# EAGLE design VM_Motor_v06 (EAGLE 7.0.0)
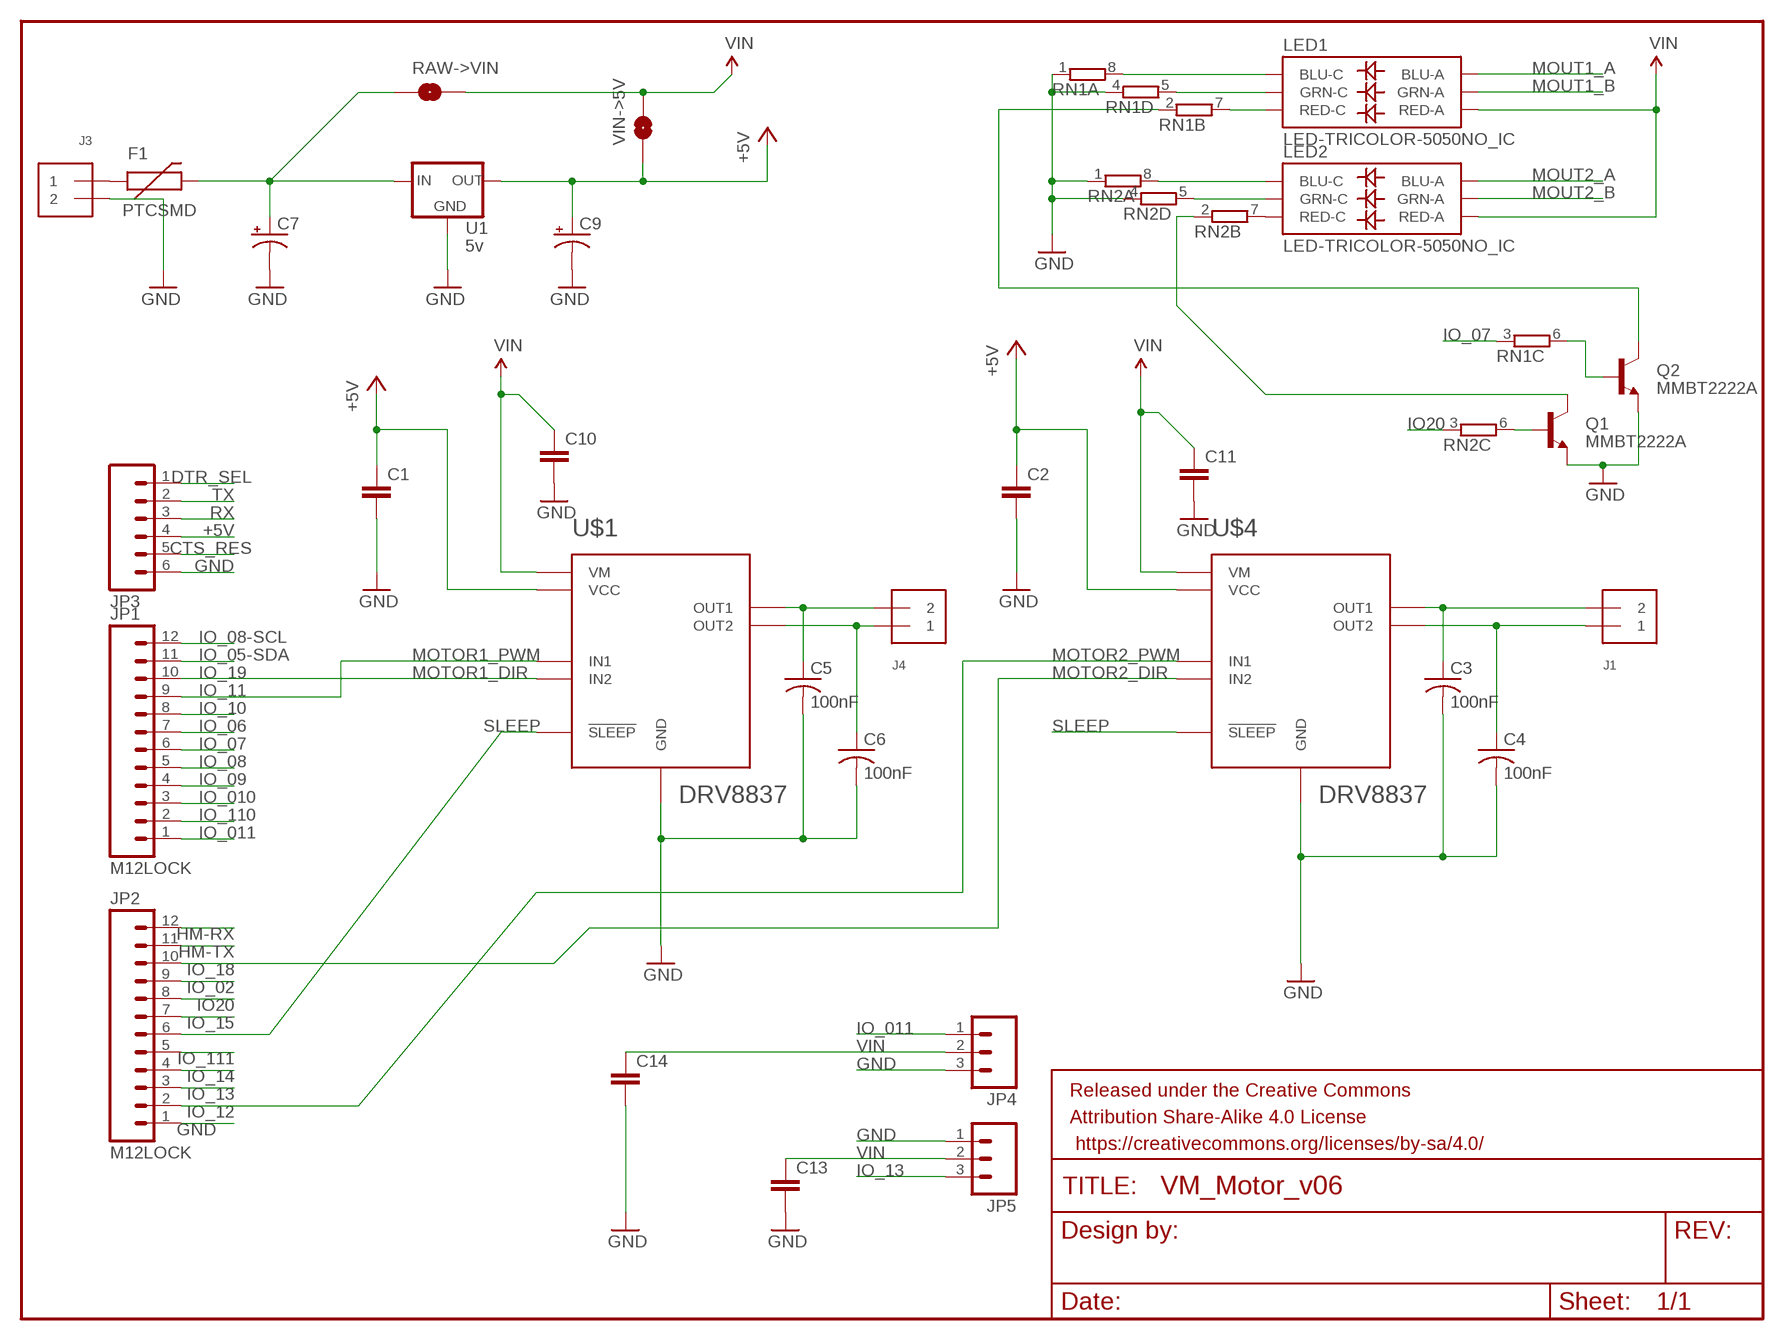
[diagram p0: schematic, sheet 1]

## Parts
C1  CAP0402-CAP  [0402-CAP]
C2  CAP0402-CAP  [0402-CAP]
C3  100nF  C-USC0402  [C0402]
C4  100nF  C-USC0402  [C0402]
C5  100nF  C-USC0402  [C0402]
C6  100nF  C-USC0402  [C0402]
C7  CPOL-US150CLZ-0810  [150CLZ-0810]
C9  CPOL-US150CLZ-0810  [150CLZ-0810]
C10  CAP0402-CAP  [0402-CAP]
C11  CAP0402-CAP  [0402-CAP]
C13  CAP0402-CAP  [0402-CAP]
C14  CAP0402-CAP  [0402-CAP]
F1  PTCSMD  [PTC-1206]
FRAME1  FRAME-LETTER  [CREATIVE_COMMONS]
J1  TERMBLOCK_1X2  [TERMBLOCK_1X2-3.5MM]
J3  TERMBLOCK_1X2  [TERMBLOCK_1X2-3.5MM]
J4  TERMBLOCK_1X2  [TERMBLOCK_1X2-3.5MM]
JP1  M12LOCK  [1X12_LOCK]
JP2  M12LOCK  [1X12_LOCK]
JP3  M06LOCK  [1X06_LOCK]
JP4  M03LOCK  [1X03_LOCK]
JP5  M03LOCK  [1X03_LOCK]
LED1  LED-TRICOLOR-5050NO_IC  [LED-TRICOLOR-5050]
LED2  LED-TRICOLOR-5050NO_IC  [LED-TRICOLOR-5050]
Q1  MMBT2222A  TRANSISTOR_NPNMMBT2222A  [SOT23-3]
Q2  MMBT2222A  TRANSISTOR_NPNMMBT2222A  [SOT23-3]
RAW->VIN  SOLDERJUMPERNO  [SJ_2S-NO]
RN1  4R-N0402ARV341  [4X0402ARV341]
RN2  4R-N0402ARV341  [4X0402ARV341]
U1  5v  V_REG_MC33269DT  [DPAK]
U$1  DRV8837  [QFN8]
U$4  DRV8837  [QFN8]
VIN->5V  SOLDERJUMPERNO  [SJ_2S-NO]

## Nets
+5V: C1.1 C2.1 C9.+ JP3.4 U1.4(OUT) U$1.P$8(VCC) U$4.P$8(VCC) VIN->5V.1
CTS_RES: JP3.5
DTR_SEL: JP3.1
GND: C1.2 C2.2 C3.2 C4.2 C5.2 C6.2 C7.- C9.- C10.2 C11.2 C13.2 C14.2 J3.2 JP2.1 JP3.6 JP4.3 JP5.1 Q1.2(E) Q2.2(E) RN1.1 RN1.4 RN2.1 RN2.4 U1.1(GND) U$1.P$4(GND) U$1.P$9(GND) U$1.P$10(GND) U$1.P$11(GND) U$4.P$4(GND) U$4.P$9(GND) U$4.P$10(GND) U$4.P$11(GND)
HM-RX: JP2.12
HM-TX: JP2.11
IO20: JP2.8 RN2.3
IO_02: JP2.9
IO_05-SDA: JP1.11
IO_06: JP1.7
IO_07: JP1.6 RN1.3
IO_08: JP1.5
IO_08-SCL: JP1.12
IO_09: JP1.4
IO_10: JP1.8
IO_010: JP1.3
IO_011: JP1.1 JP4.1
IO_13: JP2.3 JP5.3
IO_14: JP2.4
IO_15: JP2.7
IO_110: JP1.2
IO_111: JP2.5
MOTOR1_DIR: JP1.10 U$1.P$5(IN2)
MOTOR1_PWM: JP1.9 U$1.P$6(IN1)
MOTOR2_DIR: JP2.10 U$4.P$5(IN2)
MOTOR2_PWM: JP2.2 U$4.P$6(IN1)
MOUT1_A: C5.1 J4.2 LED1.3(BLU-A) U$1.P$2(OUT1)
MOUT1_B: C6.1 J4.1 LED1.1(GRN-A) U$1.P$3(OUT2)
MOUT2_A: C3.1 J1.2 LED2.3(BLU-A) U$4.P$2(OUT1)
MOUT2_B: C4.1 J1.1 LED2.1(GRN-A) U$4.P$3(OUT2)
N$2: Q1.1(B) RN2.6
N$3: LED1.4(BLU-C) RN1.8
N$4: LED1.6(GRN-C) RN1.5
N$5: LED2.4(BLU-C) RN2.8
N$7: LED1.5(RED-C) RN1.7
N$8: Q1.3(C) RN2.2
N$9: Q2.3(C) RN1.2
N$10: Q2.1(B) RN1.6
N$11: LED2.6(GRN-C) RN2.5
N$12: LED2.5(RED-C) RN2.7
N$13: F1.1 J3.1
RAW: C7.+ F1.2 RAW->VIN.1 U1.3(IN)
RX: JP3.3
SLEEP: JP2.6 U$1.P$7(!SLEEP) U$4.P$7(!SLEEP)
TX: JP3.2
VIN: C10.1 C11.1 C13.1 C14.1 JP4.2 JP5.2 LED1.2(RED-A) LED2.2(RED-A) RAW->VIN.2 U$1.P$1(VM) U$4.P$1(VM) VIN->5V.2

## Notes on the sheet
- IO_19
- IO_11
- IO_18
- IO_12

## Library data of the parts
C1 C2 C10 C11 C13 C14 = SparkFun-Capacitors:CAP: Capacitor Standard 0603 ceramic capacitor, and 0.1" leaded capacitor.
C3-C6 = resistor:C-US: CAPACITOR, American symbol
C7 C9 = resistor:CPOL-US: POLARIZED CAPACITOR, American symbol
F1 = SparkFun-PowerIC:PTC: Resettable Fuse PTC Resettable Fuse. Spark Fun Electronics SKU : COM-08357; PROD_ID: RES-11150
FRAME1 = SparkFun-Aesthetics:FRAME-LETTER: Schematic Frame Standard 8.5x11 US Letter frame
J1 J3 J4 = microbuilder:TERMBLOCK_1X2: 3.5mm Terminal block http://www.ladyada.net/library/pcb/eaglelibrary.html
JP1 JP2 = SparkFun-Connectors:M12: Header 12 Standard 12-pin 0.1" header. Use with straight break away headers (SKU : PRT-00116), right angle break away headers (PRT-00553), swiss pins (PRT-00743), machine pins (PRT-00117), and female headers (PRT-00115).
JP3 = SparkFun-Connectors:M06: Header 6 Standard 6-pin 0.1" header. Use with straight break away headers (SKU : PRT-00116), right angle break away headers (PRT-00553), swiss pins (PRT-00743), machine pins (PRT-00117), and female headers (PRT-00115). Molex polarized connector foot print use with SKU : PRT-08094 with associated crimp pins and housings. NOTES ON THE VARIANTS LOCK and LOCK_LONGPADS... This footprint was designed to help hold the alignment of a through-hole component (i.e. 6-pin header) while soldering it into place. You may notice that each hole has been shifted either up or down by 0.005 of an inch from it's more standard position (which is a perfectly straight line). This slight alteration caused the pins (the squares in the middle) to touch the edges of the holes. Because they are alternating, it causes a "brace" to hold the component in place. 0.005 has proven to be the perfect amount of "off-center" position when using our standard breakaway headers. Although looks a little odd when you look at the bare footprint, once you have a header in there, the alteration is very hard to notice. Also,if you push a header all the way into place, it is covered up entirely on the bottom side. This idea of altering the position of holes to aid alignment will be further integrated into the Sparkfun Library for other footprints. It can help hold any component with 3 or more connection pins.
JP4 JP5 = SparkFun-Connectors:M03: Header 3 Standard 3-pin 0.1" header. Use with straight break away headers (SKU : PRT-00116), right angle break away headers (PRT-00553), swiss pins (PRT-00743), machine pins (PRT-00117), and female headers (PRT-00115). Molex polarized connector foot print use with SKU : PRT-08232 with associated crimp pins and housings.
LED1 LED2 = SparkFun-LED:LED-TRICOLOR-5050
Q1 Q2 = SparkFun-DiscreteSemi:TRANSISTOR_NPN: Generic NPN BJT MMBT2222A - TRANS-08049 (SOT-23, 1A 40V) MPSA42 - TRANS-09116 (SOT-23, 500mA 300V) MMBT5088LT1G - TRANS-11160 (SOT-23, 50 mA 30V) BC547 - COM-08928 <http://www.sparkfun.com/products/8928> (TO-92 45V 100mA) (1.Collector 2.Base 3.Emitter) 2N3904 - COM-00521 <http://www.sparkfun.com/products/521> (TO-92 40V 200mA) (1.Emitter 2.Base 3.Collector) P2N2222A - COM-12852 <http://www.sparkfun.com/products/12852> (TO-92 40V 600mA) (1.Collector 2.Base 3.Emitter); PROD_ID: TRANS-08049
RAW->VIN VIN->5V = SparkFun-Retired:SOLDERJUMPER: Solder Jumper Standard SMD solder jumper. Used to automate production. Two varients : Normally Open and Normally Closed are the same, but have different paste layers. NC will have a large amount of paste and should jumper during reflow.
RN1 RN2 = resistor-dil:4R-N: Array Chip Resistor Source: RS Component / Phycomp; OC_FARNELL: unknown; OC_NEWARK: unknown
U1 = SparkFun-PowerIC:V_REG_MC33269
U$1 U$4 = bt_motordriver:DRV8837: DRV8837 Low Voltage H-Bridge The DRV8837 provides an integrated motor-driver solution for cameras, consumer products, toys, and other low-voltage or battery-powered motion-control applications. The device has one H-bridge driver, and can drive one dc motor or one winding of a stepper motor, as well as other devices like solenoids. Reference: http://www.ti.com/lit/ds/symlink/drv8837.pdf

## Board
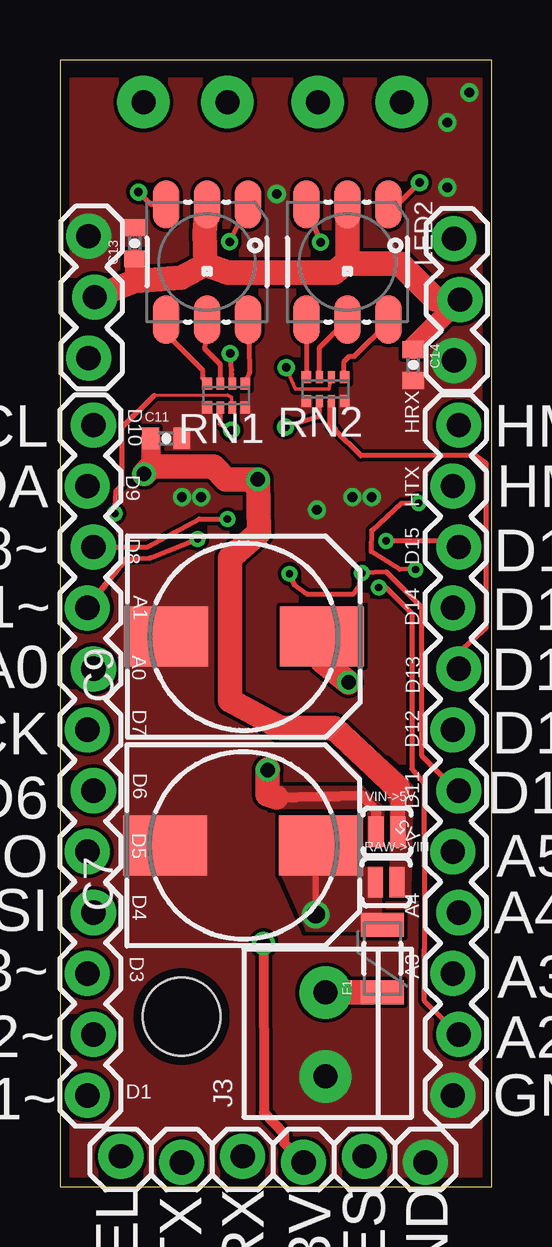
[diagram p1: board, top side]
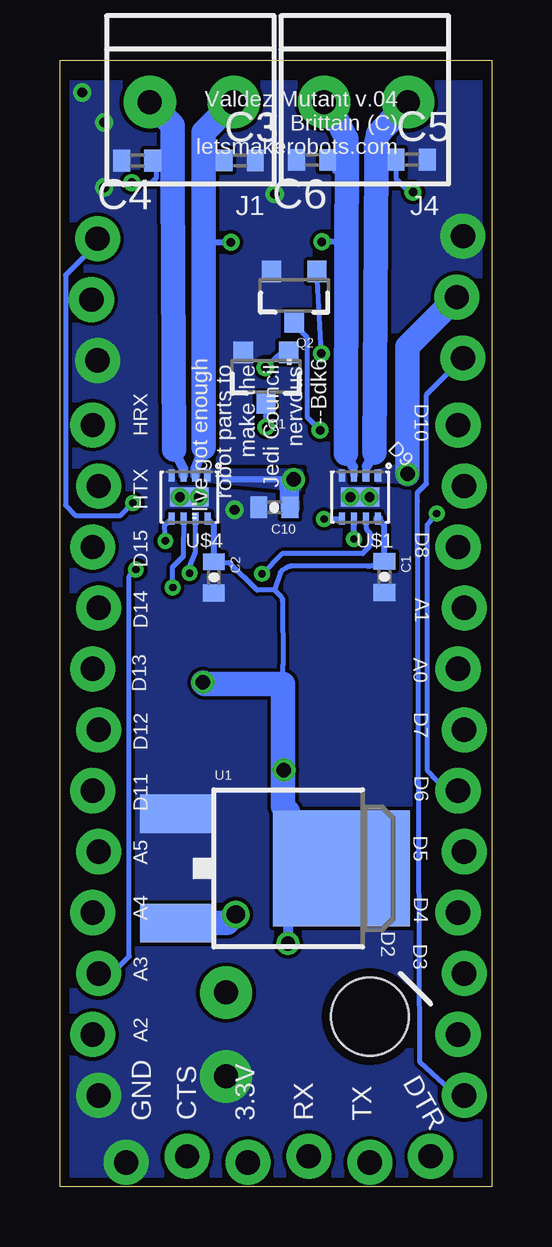
[diagram p2: board, bottom side, seen from below]

Size 18 x 46.97 mm. Coordinates in mm from the lower left corner, seen from the top.
Outline: 0,0 18,0 18,46.97 0,46.97 0,0
Copper layers (1*16): Top 0.0356mm / dielectric 1.5011mm / Bottom 0.0356mm
Design rules "LaenPCBOrder *": minimum track width 6mil, minimum drill 13mil, track to track 6mil, track to pad 6mil, pad to pad 6mil, via to via 6mil, smd to smd 6mil, copper to edge 15mil, drill to drill 6mil, minimum pad ring 7mil, minimum via ring 7mil, stop-mask expansion 3mil, vias tented up to drill 14mil, thermal gap 10mil
Holes 3.25 mm at 5.07,7.1

### Footprints (pad centres in the part's own frame; a part is rotated, then mirrored left to right if it is on the bottom)
0402-CAP = smd 0.7 x 0.9: 1 -0.65,0; 2 0.65,0
C0402 = smd 0.7 x 0.9: 1 -0.65,0; 2 0.65,0
150CLZ-0810 = smd 3.5 x 2.5: + 3.25,0; - -3.25,0
PTC-1206 = smd 1 x 1.8: 1 -1.4,0; 2 1.4,0
TERMBLOCK_1X2-3.5MM = drill 1 pad 2.184: 1 1.8,0; 2 -1.7,0
1X12_LOCK = drill 1.016 pad 1.88: 1 0,0.127; 2 2.54,-0.127; 3 5.08,0.127; 4 7.62,-0.127; 5 10.16,0.127; 6 12.7,-0.127; 7 15.24,0.127; 8 17.78,-0.127; 9 20.32,0.127; 10 22.86,-0.127; 11 25.4,0.127; 12 27.94,-0.127
1X06_LOCK = drill 1.016 pad 1.88: 1 0,0; 2 2.54,-0.254; 3 5.08,0; 4 7.62,-0.254; 5 10.16,0; 6 12.7,-0.254
1X03_LOCK = drill 1.016 pad 1.88: 1 0,0.127; 2 2.54,-0.127; 3 5.08,0.127
LED-TRICOLOR-5050 = smd 2 x 1.1: 1 -2.4,1.7; 2 -2.4,0; 3 -2.4,-1.7; 4 2.4,-1.7; 5 2.4,0; 6 2.4,1.7
SOT23-3 = smd 0.8 x 0.9: 1 -0.95,-1; 2 0.95,-1; 3 0,1.1
SJ_2S-NO = smd 0.635 x 1.27: 1 -0.45,0; 2 0.45,0
4X0402ARV341 = smd 0.4 x 0.5: 1 -0.8,-0.5; 4 0.8,-0.5; 5 0.8,0.5; 8 -0.8,0.5 | smd 0.3 x 0.5: 2 -0.25,-0.5; 3 0.25,-0.5; 6 0.25,0.5; 7 -0.25,0.5
DPAK = smd 1.6 x 3: 1 -2.28,-5.31; 3 2.28,-5.31 | smd 4.826 x 5.715: 4 0,1.588
QFN8 = smd 0.28 x 0.5: P$1 -0.75,-0.9; P$2 -0.25,-0.9 | smd 0.25 x 0.5: P$3 0.25,-0.9; P$4 0.75,-0.9; P$5 0.75,0.9; P$6 0.25,0.9; P$7 -0.25,0.9; P$8 -0.75,0.9 | smd 1.6 x 0.8: P$9 0,0 | drill 0.4 pad 0.6: P$10 0.4,0; P$11 -0.4,0

### Placement (x,y rotation side)
C1  4.47,25.43 270 bottom
C2  11.58,25.4 270 bottom
C3  10.5,42.79 0 bottom
C4  14.78,42.77 180 bottom
C5  3.33,42.81 0 bottom
C6  7.48,42.8 180 bottom
C7  7.65,14.24 0 top
C9  7.67,22.94 0 top
C10  9.06,28.32 180 bottom
C11  4.43,31.19 0 top
C13  3.12,39.33 90 top
C14  14.73,34.25 270 top
F1  13.45,9.51 90 top
FRAME1  8.64,-31.6 0 top  (outside the outline)
J1  12.46,45.21 180 bottom
J3  11.07,6.3 90 top
J4  5.18,45.21 180 bottom
JP1  1.27,3.81 90 top
JP2  16.51,3.81 90 top
JP3  2.54,1.27 0 top
JP4  1.32,34.54 90 top
JP5  16.56,34.44 90 top
LED1  6.13,38.54 270 top
LED2  11.99,38.54 270 top
Q1  9.41,33.78 180 bottom
Q2  8.23,37.16 180 bottom
RAW->VIN  13.6,12.7 0 top
RN1  6.93,32.98 0 top
RN2  11.07,33.25 0 top
U1  7.85,13.27 270 bottom
U$1  5.49,28.75 180 bottom
U$2  [OSHW_FILLX100_NOTEXT]  23.38,36.78 0 top  (outside the outline)
U$3  [OSHW_FILLX100_NOTEXT]  27.84,36.12 90 bottom  (outside the outline)
U$4  12.6,28.75 180 bottom
VIN->5V  13.64,14.8 0 top

### Tracks (layer width: path | path; a pad name or v marks a point on that pad's centre or on a via)
+5V  (via drill 0.6)
  Top 0.406: v8.49,10.14 8.51,3.1 9.35,2.23 9.35,1.83 JP3.4 | 9.04,16.23 12.57,16.31 13.18,15.7 VIN->5V.1
  Top 1.016: 9.04,16.23 8.66,16.35 v8.66,17.37 8.69,17.4 | C9.+ 10.92,21.92 v12.04,21.03
  Bottom 0.203: 9.04,24.87 8.8,25.61 arc45 8.3,25.88 5.2,25.88 arc-45 4.62,26.05 | U$4.P$8 11.85,27.8 | 11.81,27.84 arc45 U$4.P$8 | 9.04,24.87 8.8,24.62 arc45 8.71,24.4 8.68,21.79 8.69,21.78 8.69,20.95 | 9.04,24.87 9.78,24.87 10.92,26.01 11.54,26.01 | 11.58,27.59 U$4.P$8
  Bottom 0.254: 4.62,26.05 C1.1 4.47,27.45 arc-45 4.56,27.68 U$1.P$8 | C2.1 11.58,27.59
  Bottom 0.406: 8.49,15.64 8.71,15.85 | v8.49,10.14 8.49,11.54 8.49,12.9 8.31,13.09 8.31,13.27 U1.4 | U$1.P$8 arc-45 U$1.P$8 | 11.54,26.01 C2.1 | 8.71,17.33 v8.66,17.37
  Bottom 0.61: 8.71,15.85 8.71,16.9
  Bottom 1.016: 8.49,12.9 8.49,15.64 | 8.71,16.9 8.69,20.95 11.96,20.95 v12.04,21.03 | 8.71,15.85 8.71,17.33
  pour Top (no thermals): 12.95,14.25 12.95,15.7 12.8,15.85 8.92,15.85 8.92,16.61 12.57,16.61 13.41,15.77 13.41,15.7 13.34,14.25
GND  (via drill 0.41)
  other vias: 16.15,41.66 17.07,45.62 10.72,28.22 9.04,41.39 16.15,44.36
  pour Bottom (rank 6, no thermals): 0.1,45.92 0,0 17.78,0 17.88,45.92
  pour Top (rank 6, no thermals): 0.1,46.02 0,0 17.78,0 17.98,46.02
IO20
  Top 0.152: RN2.3 11.35,32.79 11.3,32.74
  Top 0.203: JP2.8 16.64,22.3 17.78,23.3 17.78,30.16 17.35,30.48 12.55,30.48 11.46,31.57
  Top 0.305: 11.46,31.57 11.3,31.73 11.3,32.74
IO_07  (via drill 0.3 pad 0.3)
  Top 0.152: 3.93,32.99 6.99,33 7.17,32.93 7.17,32.55 7.24,32.49 RN1.3
  Top 0.203: v2.29,28.07 2.34,28.98 2.34,28.99 2.6,29.26 2.6,31.67 3.93,32.99
  Bottom 0.203: JP1.6 1.87,16.51 2.67,17.35 2.68,27.59 2.58,27.71 v2.29,28.07
IO_011
  Bottom 0.203: JP1.1 1.5,3.81 2.98,5.18 3.09,28.6 3.09,28.94 2.72,29.31 2.72,33.02 JP4.1
IO_13  (via drill 0.3)
  Top 0.203: v14.83,25.73 14.16,25.74 12.98,26.48 13.01,27.36 14.25,28.5 v14.96,28.5
  Top 0.254: 14.83,28.37 v14.96,28.5
  Bottom 0.203: v14.83,25.73 15.11,25.45 15.11,9.6 15.82,8.89 JP2.3 | JP5.3 16.43,39.34 17.77,38.01 17.77,28.4 17.36,27.99 15.47,27.99 v14.96,28.5
MOTOR1_DIR  (via drill 0.3)
  Top 0.203: JP1.10 3.66,26.67 5.82,27.84 v6.99,27.84
  Bottom 0.254: v6.99,27.84 6.25,27.84 U$1.P$5
MOTOR1_PWM  (via drill 0.3)
  Top 0.203: 2.74,26.16 3.76,26.21 v5.74,27
  Top 0.254: JP1.9 2.74,26.16
  Bottom 0.254: v5.74,27 U$1.P$6
MOTOR2_DIR  (via drill 0.3 pad 0.3)
  Top 0.203: JP2.10 16.29,26.91 v13.6,26.92
  Bottom 0.203: v13.6,26.92 13.64,27.56 U$4.P$5
MOTOR2_PWM  (via drill 0.3)
  Top 0.203: v13.3,24.98 13.59,24.98 14.67,23.9 14.67,17.42 15.18,16.82 15.2,9.88 15.19,9.87 15.19,7.78 JP2.2
  Bottom 0.203: U$4.P$6 12.85,27.05 12.85,26.29 13.3,25.84 v13.3,24.98
MOUT1_A  (via drill 0.36 pad 0.36)
  Top 0.203: LED1.3 3.8,40.94 v3.28,41.47
  Bottom 0.203: 4.3,42.85 4.8,42.85 4.8,42.83 | v3.28,41.47 3.43,41.47 3.96,42 3.96,42.8 C5.1
  Bottom 0.305: U$1.P$2 5.2,30.04
  Bottom 0.406: 5.2,30.04 4.89,30.6 | 4.3,42.85 C5.1
  Bottom 1.016: 4.89,30.6 4.8,42.83 4.83,43.48 4.75,43.88 J4.2
MOUT1_B  (via drill 0.36 pad 0.36)
  Top 0.203: LED1.1 v7.07,39.4
  Bottom 0.152: 6.26,39.33 6.05,39.38
  Bottom 0.203: 6.03,42.57 6.54,42.54 | 6.54,42.54 C6.1 | 6.54,42.54 6.54,42.33
  Bottom 0.254: 6.26,39.33 6.87,39.41 v7.07,39.4
  Bottom 0.305: U$1.P$3 5.78,30.02
  Bottom 0.406: 5.78,30.02 6.08,30.56
  Bottom 1.016: 6.08,30.56 6.05,39.38 6.03,42.57 6.06,43.68 6.41,44.4 J4.1
MOUT2_A  (via drill 0.36 pad 0.36)
  Top 0.152: LED2.3 10.29,40.87 10.29,40.82
  Top 0.203: 10.29,40.82 v10.87,39.37
  Bottom 0.152: 10.79,39.37 v10.87,39.37 | 12.06,39.37 12,39.37
  Bottom 0.203: C3.1 11.95,42.79 12,42.74
  Bottom 0.254: 12,39.37 v10.87,39.37
  Bottom 0.406: U$4.P$2 12.35,29.95 12,30.81
  Bottom 1.016: 12,30.81 12,39.37 12,42.74 12,43.97 J1.2
MOUT2_B  (via drill 0.36 pad 0.36)
  Top 0.152: LED2.1 13.64,40.87 13.69,40.82
  Top 0.203: 13.69,40.82 13.96,40.82 v15,41.86
  Bottom 0.203: 13.3,42.67 13.41,42.79 C4.1 13.97,42.61 13.97,42.06 14.17,41.86 v15,41.86
  Bottom 0.406: U$4.P$3 12.85,29.94 13.25,30.72
  Bottom 1.016: 13.25,30.72 13.3,41.98 13.3,42.67 13.3,44.25 J1.1 13.74,44.69
N$2  (via drill 0.36 pad 0.3)
  Top 0.152: v9.44,34.15 9.82,33.25 11.23,33.25 11.3,33.72 11.35,33.71 RN2.6
  Top 0.203: 11.3,33.72 11.3,33.74
  Bottom 0.203: Q1.1 8.74,34.78 v9.44,34.15
N$3
  Top 0.152: RN1.8 6.17,33.55 6.12,33.55
  Top 0.203: LED1.4 4.33,35.66 5.94,34.05 5.94,33.73 6.12,33.55
N$4
  Top 0.152: RN1.5 7.7,33.55 7.72,33.55
  Top 0.203: LED1.6 7.73,35.5 7.89,35.12 7.9,33.92 7.72,33.55
N$5
  Top 0.152: RN2.8 10.29,33.86 10.29,33.78 | 10.29,35.99 LED2.4
  Top 0.203: 10.29,36.02 10.29,35.99 10.29,33.78 10.25,33.74
N$7
  Top 0.152: RN1.7 6.63,33.55 6.67,33.55
  Top 0.203: LED1.5 6.03,34.94 6.68,34.29 6.68,33.55 6.67,33.55
N$8  (via drill 0.36 pad 0.3)
  Top 0.152: RN2.2 10.74,32.79 10.8,32.74
  Top 0.203: 10.8,32.74 10.8,32.1 v9.4,31.68
  Bottom 0.203: v9.4,31.68 9.41,31.96 Q1.3
N$9  (via drill 0.36 pad 0.3)
  Top 0.152: RN1.2 6.63,32.49 RN1.2
  Top 0.203: 6.67,32.55 RN1.2 6.67,31.79 v7.16,31.54
  Bottom 0.203: Q2.3 8.05,35.86 7.95,35.66 7.68,35.39 7.68,32.07 v7.16,31.54
N$10  (via drill 0.36 pad 0.3)
  Top 0.152: RN1.6 7.24,33.55 7.17,33.55
  Top 0.203: 7.17,33.55 7.16,33.76 7.16,33.87 7.16,34.06 v7.1,34.73
  Bottom 0.203: v7.1,34.73 Q2.1
N$11
  Top 0.152: RN2.5 11.81,33.86 11.85,33.86 | 13.69,36.02 13.79,36.14 LED2.6
  Top 0.203: 11.85,33.74 11.85,33.86 11.85,34.39 12.08,34.62 12.29,34.62 13.69,36.02
  Top 0.305: 13.69,36.02 13.38,35.85
N$12
  Top 0.203: RN2.7 10.82,34.98 LED2.5
N$13
  Top 1.016: J3.1 13.44,8.1 F1.1
RAW  (via drill 0.76)
  Top 0.254: v10.67,11.35 10.67,13.49 10.74,13.56
  Bottom 1.016: U1.3 11.03,10.99 v10.67,11.35
  pour Top (isolate 0.254, no thermals): 13.34,10.74 13.31,13.23 9.27,13.13 10.34,10.74
SLEEP  (via drill 0.3)
  Top 0.203: JP2.6 16.55,16.51 15.1,17.96 15.1,24.14 13.61,25.63 v12.6,25.58 12.5,25.07 12.24,24.71 11.05,24.71 10.28,24.72 9.79,25.07 v9.58,25.55
  Bottom 0.203: U$1.P$7 5.24,27.54 arc-45 5.14,27.32 5.05,27.23 5.05,26.85 arc45 5.15,26.63 5.38,26.39 8.74,26.39 v9.58,25.55 | 12.66,25.68 12.34,26.44 U$4.P$7
  Bottom 0.254: v12.6,25.58 arc45 12.66,25.68 | U$4.P$7 arc-45 U$4.P$7
VIN  (via drill 0.6)
  Top 0.61: VIN->5V.2 14.09,16.62
  Top 0.813: 3.81,30.02 3.81,31.16 C11.1 | C14.1 14.68,34.98 JP5.2 | 3.12,37.74 C13.1
  Top 1.016: 14.09,16.62 11.43,19.13 9.22,19.13 7.09,20.27 7.09,26.21 8.31,27.28 v8.26,29.49 6.93,29.49 6.4,30.02 3.81,30.02 v3.5,29.72 | LED1.2 6.03,39.79 6.08,38.44 | 6.08,38.44 5.05,37.9 3.12,37.74 JP4.2 | LED2.2 11.99,38.58 | 11.99,38.58 11.46,38.1 7.01,38.1 6.08,38.44 | JP5.2 15.67,36.98 14.17,38.48 12.09,38.48 11.99,38.58
  Bottom 0.254: v8.26,29.49 11.12,29.49
  Bottom 0.813: C10.1 8.46,29.34 v8.26,29.49
  Bottom 1.016: v3.5,29.72 3.5,35.03 JP4.2
  pour Top (no thermals): 13.87,12.19 14.55,12.19 14.63,16.69 13.56,17.68 13.41,17.68 12.95,17.14 13.56,16.54 13.87,16
  pour Bottom (no thermals): 4.78,29.44 3.25,29.39 3.1,30.23 4.75,29.82
  pour Bottom (no thermals): 12.01,29.46 8,29.08 7.95,29.84 11.99,29.84

### Text on the board
tNames: Valdez Mutant v.04 / T. Brittain (C) | D10 SCL | HRX | HM-RX | D10 | D9 SDA | D9 | HTX | HM-TX | D8~ | D8 | D15 | D15 | A1~ | A1 | D14 | D14~ | A0 | A0 | D13 | D13 | D7 SCK | D7 | D12 | D12~ | D6 | D6 | D11 | D11 | D5~MISO | D5 | A5 | A5 | D4~MOSI | D4 | A4 | A4~WAKE | D3~ | D3 | A3 | A3~ | D2~ | A2~ | D1~ | D1 | GND | TX | RX | 3.3V | GND | DTR/SEL | CTS/RES
bNames: Valdez Mutant v.04 / T. Brittain (C) / letsmakerobots.com | "I've got enough / robot parts to / make the / Jedi Council / nervous" / --Bdk6 | D10 | HRX | D9 | HTX | D8 | D15 | A1 | D14 | A0 | D13 | D7 | D12 | D6 | D11 | D5 | A5 | D4 | A4 | D2 | D3 | A3 | A2 | DTR | TX | RX | 3.3V | CTS | GND